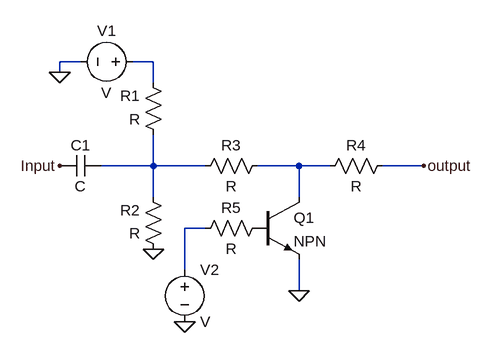
[diagram p0: schematic Draft3.asc]
Draft3.asc, the LTspice schematic file:
Version 4
SHEET 1 880 680
WIRE -224 -16 -256 -16
WIRE -112 -16 -144 -16
WIRE -256 0 -256 -16
WIRE -112 16 -112 -16
WIRE -112 144 -112 96
WIRE -112 144 -192 144
WIRE -32 144 -112 144
WIRE 112 144 48 144
WIRE 160 144 112 144
WIRE 304 144 240 144
WIRE -112 192 -112 144
WIRE 112 192 112 144
WIRE -32 240 -64 240
WIRE -64 304 -64 240
WIRE 112 336 112 288
FLAG -112 272 0
FLAG 112 336 0
FLAG -256 0 0
FLAG -64 384 0
FLAG -256 144 Input
FLAG 304 144 output
SYMBOL res -96 112 R180
WINDOW 0 36 76 Left 0
WINDOW 3 36 40 Left 0
SYMATTR InstName R1
SYMBOL res -96 288 R180
WINDOW 0 36 76 Left 0
WINDOW 3 36 40 Left 0
SYMATTR InstName R2
SYMBOL res 64 128 R90
WINDOW 0 0 56 VBottom 0
WINDOW 3 32 56 VTop 0
SYMATTR InstName R3
SYMBOL res 256 128 R90
WINDOW 0 0 56 VBottom 0
WINDOW 3 32 56 VTop 0
SYMATTR InstName R4
SYMBOL cap -192 128 R90
WINDOW 0 0 32 VBottom 0
WINDOW 3 32 32 VTop 0
SYMATTR InstName C1
SYMBOL npn 48 192 R0
SYMATTR InstName Q1
SYMBOL res 64 224 R90
WINDOW 0 0 56 VBottom 0
WINDOW 3 32 56 VTop 0
SYMATTR InstName R5
SYMBOL voltage -128 -16 R90
WINDOW 0 -32 56 VBottom 0
WINDOW 3 32 56 VTop 0
SYMATTR InstName V1
SYMBOL voltage -64 288 R0
SYMATTR InstName V2

The netlist it stands for:
* Draft3.asc
R1 N002 N001 R
R2 0 N002 R
R3 N003 N002 R
R4 output N003 R
C1 N002 Input C
Q1 N003 P001 0 0 NPN
R5 P001 N004 R
V1 N001 0 V
V2 N004 0 V
.model NPN NPN
.model PNP PNP
.lib standard.bjt
.backanno
.end